# EAGLE design DOC-00001 (EAGLE 6.5.0)
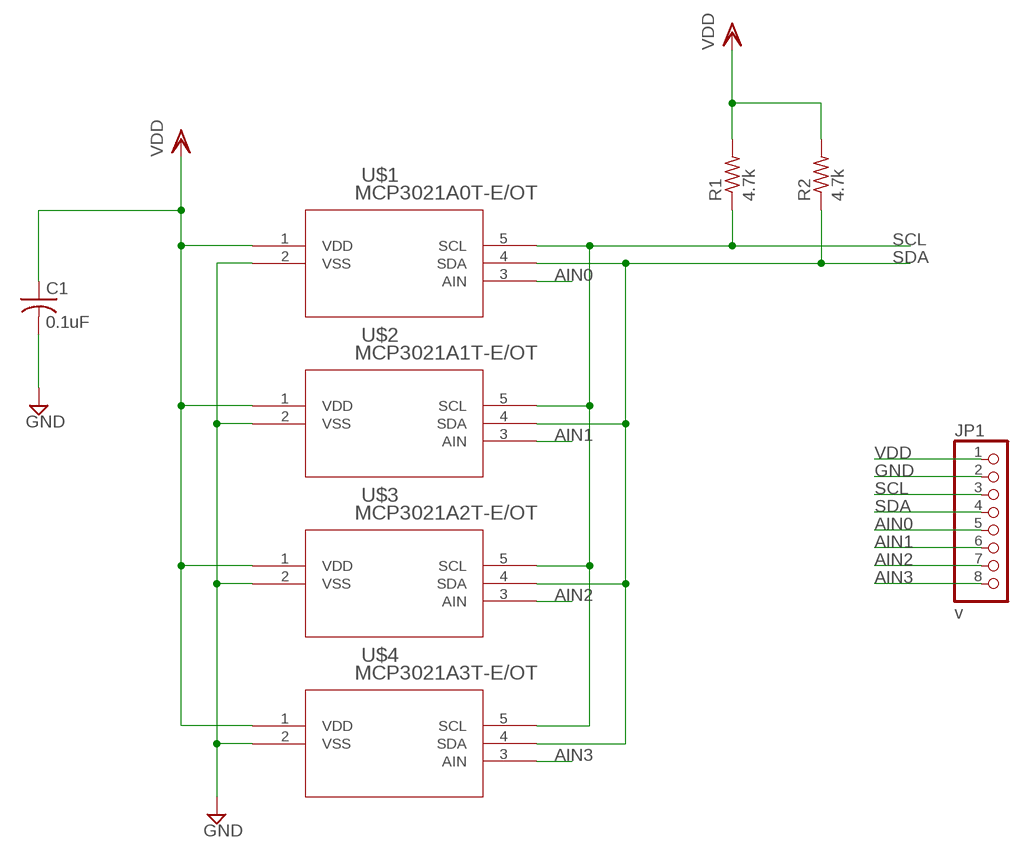
[diagram p0: schematic, sheet 1]

## Parts
C1  0.1uF  C-USC0805K  [C0805K]
JP1  v  PINHD-1X8  [1X08]
R1  4.7k  R-US_R0805  [R0805]
R2  4.7k  R-US_R0805  [R0805]
U$1  MCP3021A0T-E/OT  MCP3021XX-X/OT  [SOT-23-5_MC]
U$2  MCP3021A1T-E/OT  MCP3021XX-X/OT  [SOT-23-5_MC]
U$3  MCP3021A2T-E/OT  MCP3021XX-X/OT  [SOT-23-5_MC]
U$4  MCP3021A3T-E/OT  MCP3021XX-X/OT  [SOT-23-5_MC]

## Nets
AIN0: JP1.5 U$1.3(AIN)
AIN1: JP1.6 U$2.3(AIN)
AIN2: JP1.7 U$3.3(AIN)
AIN3: JP1.8 U$4.3(AIN)
GND: C1.2 JP1.2 U$1.2(VSS) U$2.2(VSS) U$3.2(VSS) U$4.2(VSS)
SCL: JP1.3 R1.1 U$1.5(SCL) U$2.5(SCL) U$3.5(SCL) U$4.5(SCL)
SDA: JP1.4 R2.1 U$1.4(SDA) U$2.4(SDA) U$3.4(SDA) U$4.4(SDA)
VDD: C1.1 JP1.1 R1.2 R2.2 U$1.1(VDD) U$2.1(VDD) U$3.1(VDD) U$4.1(VDD)

## Library data of the parts
C1 = resistor:C-US: CAPACITOR, American symbol; MPN: VJ0805Y104MXXAC; PRICE: 0.06; STORE: mouser.com
JP1 = pinhead:PINHD-1X8: PIN HEADER; MPN: 825433-8; PRICE: 0.84; STORE: mouser.com
R1 R2 = resistor:R-US_: RESISTOR, American symbol; MPN: CRCW08054K70FKEA; PRICE: 0.08; STORE: mouser.com
U$1 = MCP3021AX:MCP3021XX-X/OT; MPN: MCP3021A0T-E/OT; PRICE: 1.07; STORE: microchipdirect.com
U$2 = MCP3021AX:MCP3021XX-X/OT; MPN: MCP3021A1T-E/OT; PRICE: 1.07; STORE: microchipdirect.com
U$3 = MCP3021AX:MCP3021XX-X/OT; MPN: MCP3021A2T-E/OT; PRICE: 1.07; STORE: microchipdirect.com
U$4 = MCP3021AX:MCP3021XX-X/OT; MPN: MCP3021A3T-E/OT; PRICE: 1.07; STORE: microchipdirect.com

## Board
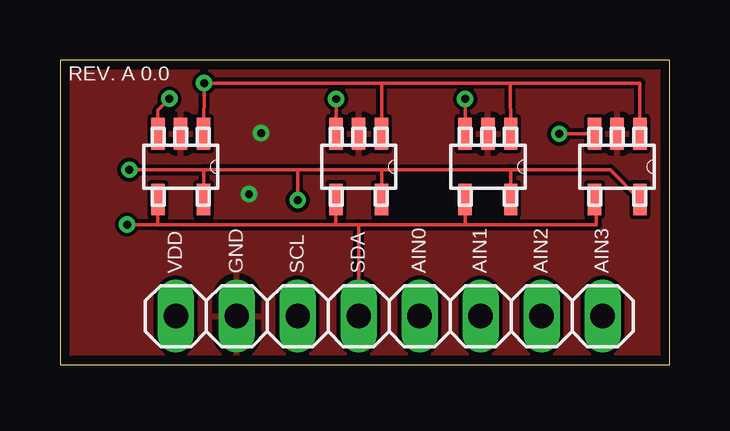
[diagram p1: board, top side]
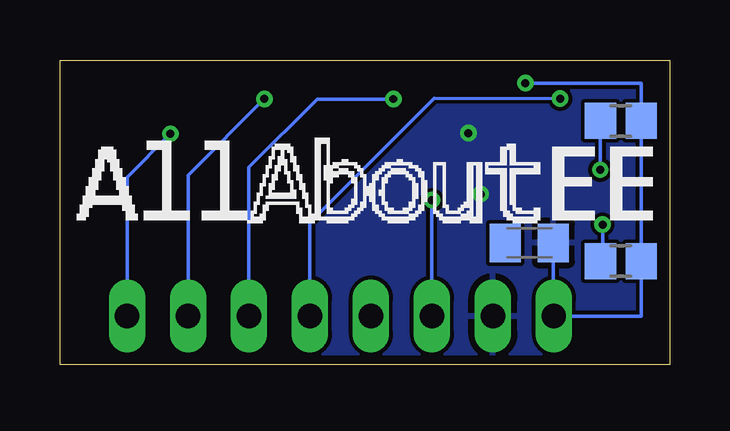
[diagram p2: board, bottom side, seen from below]

Size 25.4 x 12.7 mm. Coordinates in mm from the lower left corner, seen from the top.
Outline: 0,0 25.4,0 25.4,12.7 0,12.7 0,0
Copper layers (1*16): Top 0.0356mm / dielectric 1.5011mm / Bottom 0.0356mm
Design rules "oshpark": minimum track width 6mil, minimum drill 13mil, track to track 6mil, track to pad 6mil, pad to pad 6mil, via to via 6mil, smd to smd 6mil, copper to edge 15mil, drill to drill 6mil, minimum pad ring 7mil, minimum via ring 7mil, stop-mask expansion 3mil, vias tented up to drill 0mil, thermal gap 10mil

### Footprints (pad centres in the part's own frame; a part is rotated, then mirrored left to right if it is on the bottom)
C0805K = smd 1.3 x 1.6: 1 -1,0; 2 1,0
1X08 = drill 1.016 long: 1 -8.89,0; 2 -6.35,0; 3 -3.81,0; 4 -1.27,0; 5 1.27,0; 6 3.81,0; 7 6.35,0; 8 8.89,0
R0805 = smd 1.3 x 1.5: 1 -0.85,0; 2 0.85,0
SOT-23-5_MC = smd 1.321 x 0.559: 1 -1.371,0.95; 2 -1.371,0; 3 -1.371,-0.95; 4 1.371,-0.95; 5 1.371,0.95

### Placement (x,y rotation side)
C1  5.84,5.08 0 bottom
JP1  13.72,2.03 0 top
R1  2.03,10.16 0 bottom
R2  2.03,4.32 0 bottom
U$1  5.03,8.26 270 top
U$2  12.45,8.26 270 top
U$3  17.83,8.26 270 top
U$4  23.22,8.26 270 top

### Tracks (layer width: path | path; a pad name or v marks a point on that pad's centre or on a via)
AIN0  (via drill 0.33)
  Top 0.152: U$1.3 4.08,10.61 v4.56,11.09
  Bottom 0.152: JP1.5 14.99,5.92 9.8,11.1 v4.56,11.09
AIN1  (via drill 0.33)
  Top 0.152: U$2.3 v11.51,11.07
  Bottom 0.152: v11.51,11.07 14.68,11.07 17.53,8.23 JP1.6
AIN2  (via drill 0.33)
  Top 0.152: U$3.3 v16.88,11.08
  Bottom 0.152: v16.88,11.08 20.07,7.89 JP1.7
AIN3  (via drill 0.33)
  Top 0.152: U$4.3 v20.8,9.63
  Bottom 0.152: v20.8,9.63 22.61,7.82 JP1.8
GND  (via drill 0.33)
  other vias: 7.87,7.11 8.38,9.65
  pour Top: -0.25,13.21 25.91,13.21 25.91,-0.51 -0.51,-0.51 -0.51,13.21
  pour Bottom: -0.76,13.46 26.16,13.46 26.16,-0.76 -0.76,-0.76
SCL  (via drill 0.33)
  Top 0.152: 13.4,8.13 18.78,8.13 | 18.78,8.13 22.92,8.13 U$4.5 | U$2.5 13.4,8.13 | U$3.5 18.78,8.13 | v2.89,8.13 5.98,8.13 | 5.98,8.13 U$1.5 | 13.4,8.13 9.91,8.13 | 9.91,8.13 5.98,8.13 | v9.91,6.86 9.91,8.13
  Bottom 0.152: JP1.3 v9.91,6.86 | R1.1 v2.89,8.13
SDA  (via drill 0.33)
  Top 0.152: 4.06,5.84 11.5,5.84 | 11.5,5.84 12.45,5.84 | 12.45,5.84 16.88,5.84 | 16.88,5.84 22.35,5.84 22.35,6.88 U$4.4 | U$2.4 11.5,5.84 | U$3.4 16.88,5.84 | JP1.4 12.45,5.84 | U$1.4 4.06,6.88 4.06,5.84 | 4.06,5.84 v2.79,5.84
  Bottom 0.152: v2.79,5.84 2.79,4.32 R2.1
VDD  (via drill 0.33)
  Top 0.152: U$4.1 24.17,11.74 18.77,11.74 | 18.77,11.74 13.41,11.74 | 13.41,11.74 v6.01,11.74 U$1.1 | U$3.1 18.77,11.74 | U$2.1 13.41,11.74
  Bottom 0.152: 4.84,5.08 JP1.1 1.18,2.03 R2.2 R1.2 1.18,11.74 v6.01,11.74

### Text on the board
tPlace: REV. A 0.0
tNames: VDD | GND | SCL | SDA | AIN0 | AIN1 | AIN2 | AIN3